# EAGLE design frontend_v2 (EAGLE 6.2)

## Sheet 1 of 4
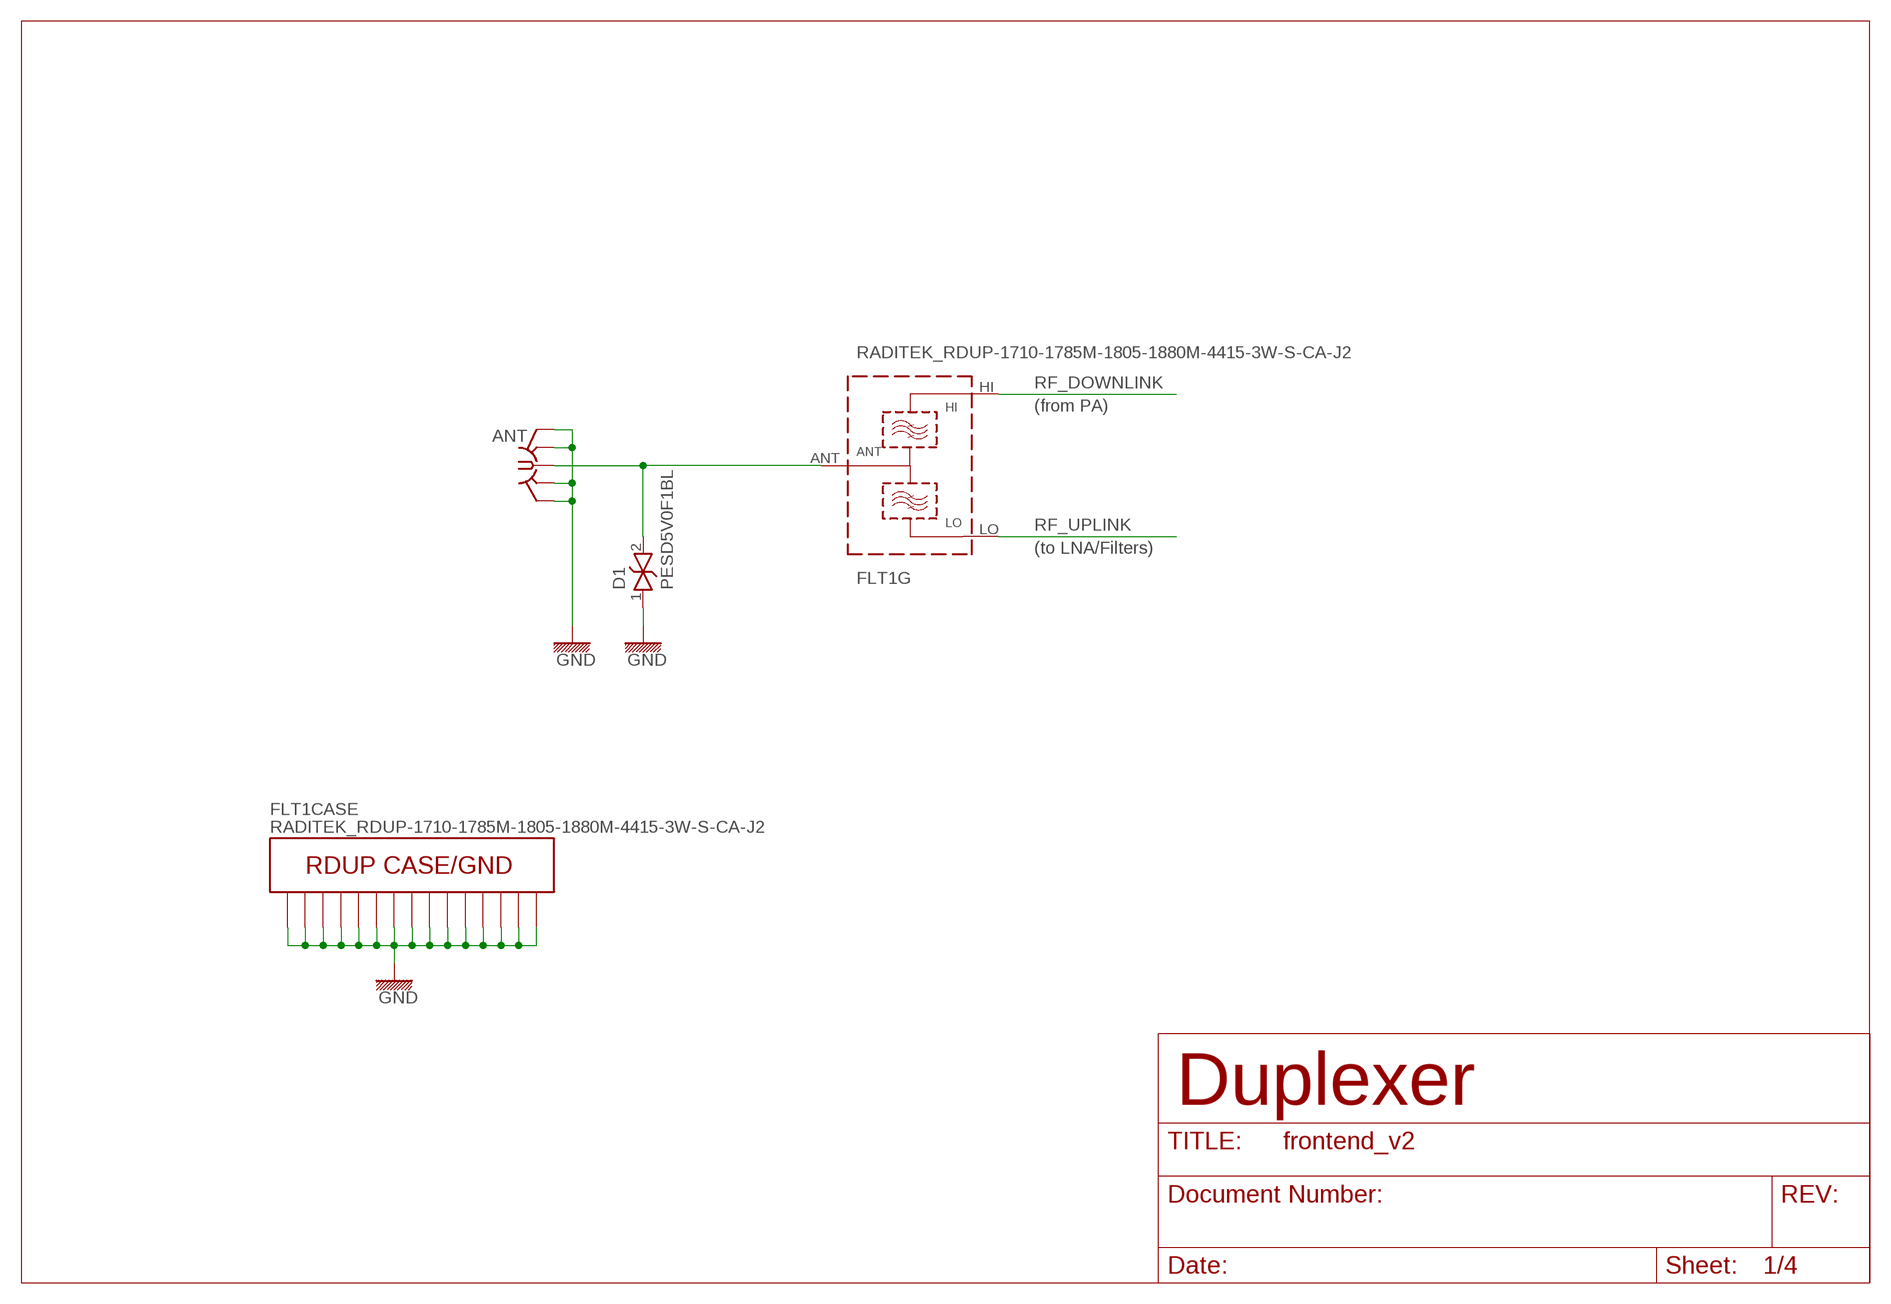
[diagram p0: schematic, sheet 1]

### Parts
ANT  SMA-F-S-TH  [SMA-F-S-TH]
D1  PESD5V0F1BL  D_ESD_SOD882  [SOD882]
FLT1  RADITEK_RDUP-1710-1785M-1805-1880M-4415-3W-S-CA-J2  [RADITEK_RDUP_4415]

### Nets
GND: ANT.G1(GND) ANT.G2(GND) ANT.G3(GND) ANT.G4(GND) D1.1 FLT1.GND@1(CASE:GND) FLT1.GND@2(CASE:GND) FLT1.GND@3(CASE:GND) FLT1.GND@4(CASE:GND) FLT1.GND@5(CASE:GND) FLT1.GND@6(CASE:GND) FLT1.GND@7(CASE:GND) FLT1.GND@8(CASE:GND) FLT1.GND@9(CASE:GND) FLT1.GND@10(CASE:GND) FLT1.GND@11(CASE:GND) FLT1.GND@12(CASE:GND) FLT1.GND@13(CASE:GND) FLT1.GND@14(CASE:GND) FLT1.GND@15(CASE:GND) ; also sheet 2,3,4
RF_ANT: ANT.C D1.2 FLT1.ANT(G:ANT)
RF_DOWNLINK: FLT1.HI(G:HI) ; also sheet 3
RF_UPLINK: FLT1.LO(G:LO) ; also sheet 2

### Notes on the sheet
- (from PA)
- (to LNA/Filters)
- Duplexer

## Sheet 2 of 4
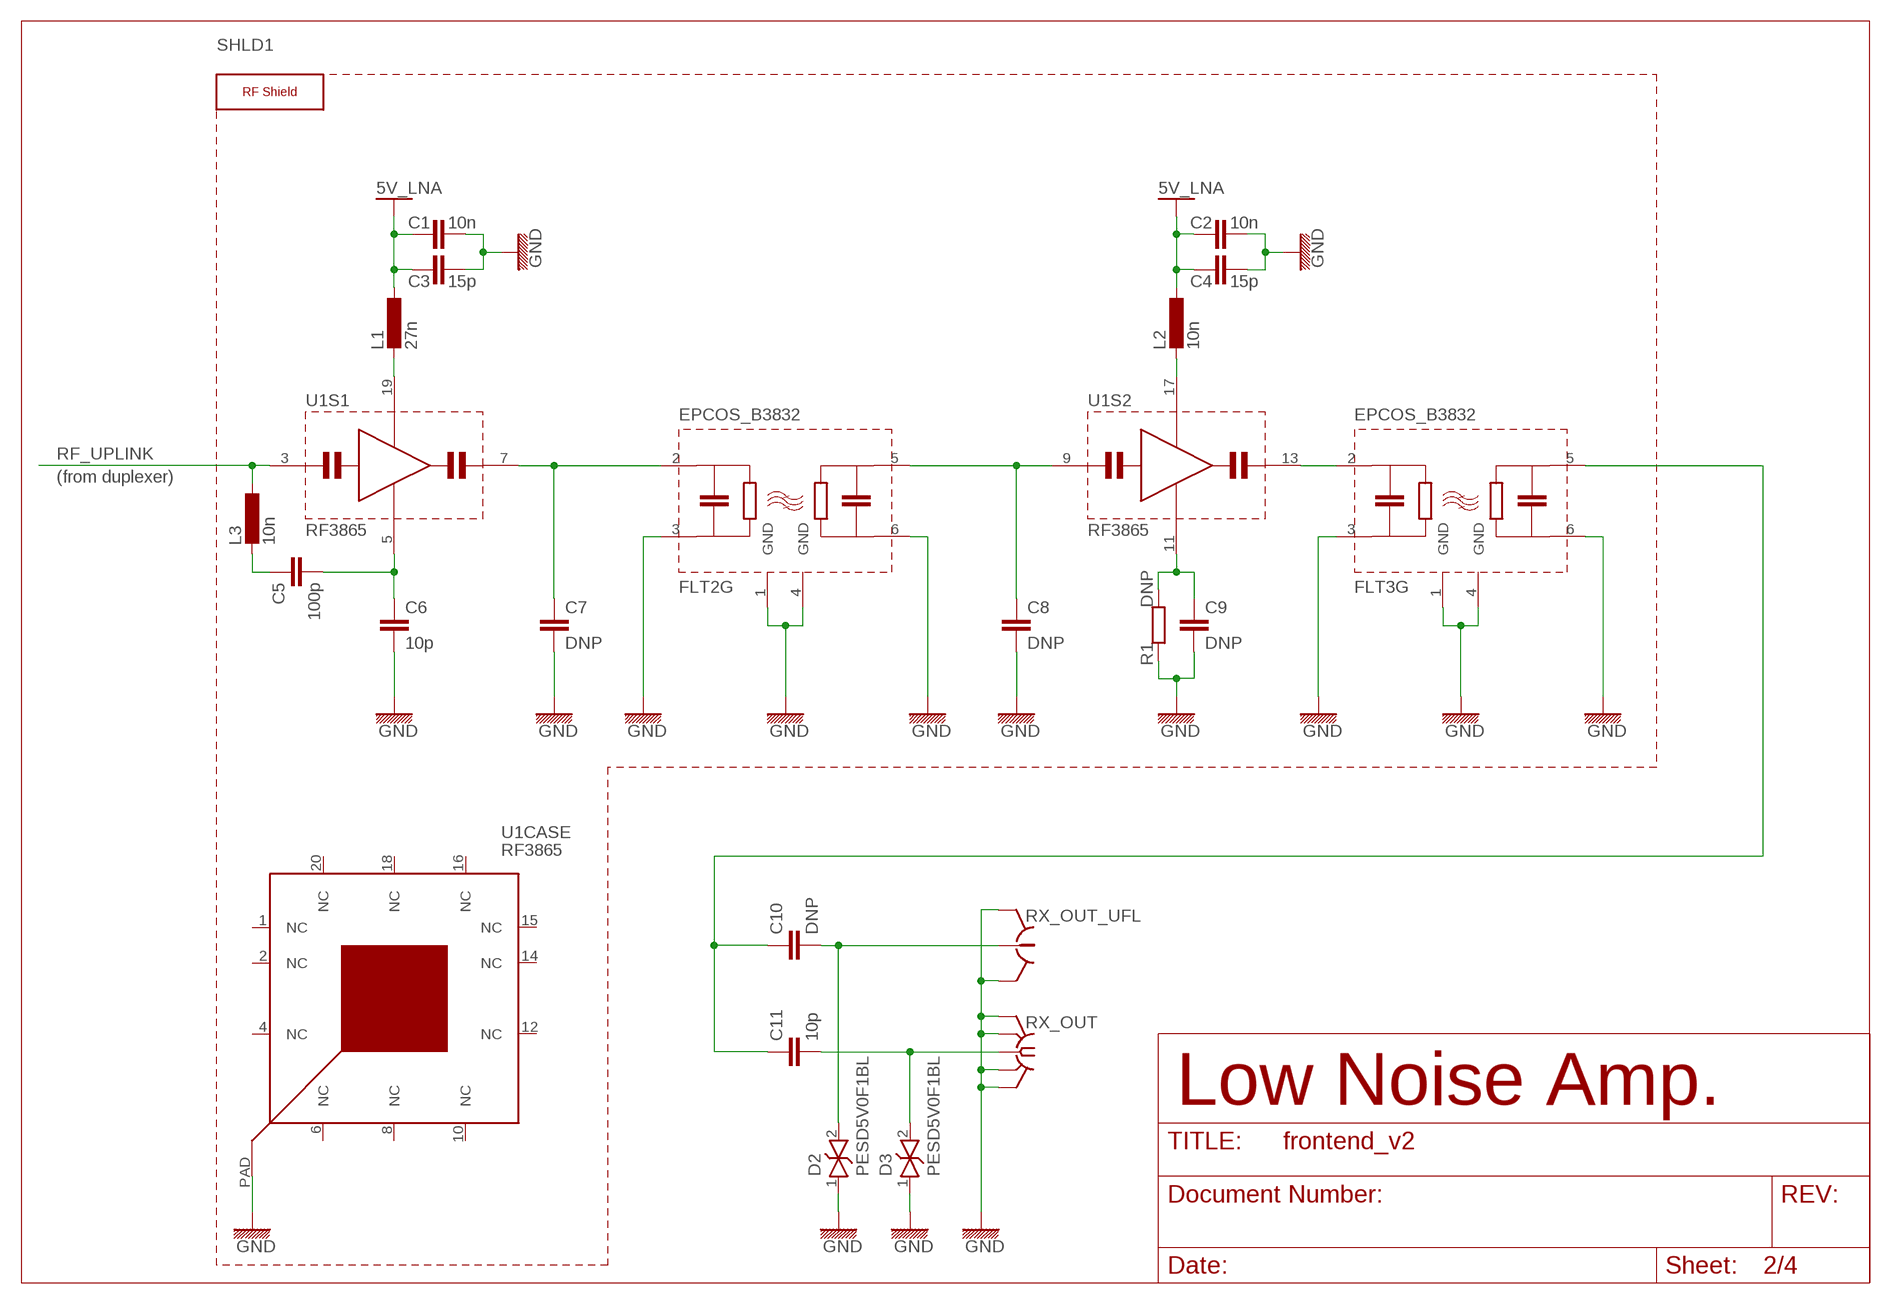
[diagram p1: schematic, sheet 2]

### Parts
C1  10n  C-EU_0603  [0603]
C2  10n  C-EU_0603  [0603]
C3  15p  C-EU_0603  [0603]
C4  15p  C-EU_0603  [0603]
C5  100p  C-EU_0603  [0603]
C6  10p  C-EU_0603  [0603]
C7  DNP  C-EU_0603  [0603]
C8  DNP  C-EU_0603  [0603]
C9  DNP  C-EU_0603  [0603]
C10  DNP  C-EU_0603  [0603]
C11  10p  C-EU_0603  [0603]
D2  PESD5V0F1BL  D_ESD_SOD882  [SOD882]
D3  PESD5V0F1BL  D_ESD_SOD882  [SOD882]
FLT2  EPCOS_B3832  [DCC6C]
FLT3  EPCOS_B3832  [DCC6C]
L1  27n  L-EU_0603  [0603]
L2  10n  L-EU_0603  [0603]
L3  10n  L-EU_0603  [0603]
R1  DNP  R-EU_0603  [0603]
RX_OUT  SMA-F-S-TH  [SMA-F-S-TH]
RX_OUT_UFL  HRS_UFL  [HRS_UFL]
SHLD1  SHIELD25X25  [WE-SHC-SMD_25X25]
U1  RF3865  [QFN20_5X5_PAD]

### Nets
5V_LNA: C1.1 C2.1 C3.1 C4.1 L1.1 L2.1 ; also sheet 4
GND: C1.2 C2.2 C3.2 C4.2 C6.2 C7.2 C8.2 C9.2 D2.1 D3.1 FLT2.1(CASE:GND) FLT2.3(G:IN_GND) FLT2.4(CASE:GND) FLT2.6(G:OUT_GND) FLT3.1(CASE:GND) FLT3.3(G:IN_GND) FLT3.4(CASE:GND) FLT3.6(G:OUT_GND) R1.1 RX_OUT.G1(GND) RX_OUT.G2(GND) RX_OUT.G3(GND) RX_OUT.G4(GND) RX_OUT_UFL.GND@1(GND) RX_OUT_UFL.GND@2(GND) U1.PAD(CASE:CASE_GND) ; also sheet 1,3,4
N$1: L1.2 U1.19(S1:VDD)
N$4: C5.1 L3.2
N$5: C5.2 C6.1 U1.5(S1:AC_GND)
N$6: C9.1 R1.2 U1.11(S2:AC_GND)
N$8: C10.2 D2.2 RX_OUT_UFL.SIG
N$9: C10.1 C11.1 FLT3.5(G:OUT)
N$10: L2.2 U1.17(S2:VDD)
RF_UPLINK: L3.1 U1.3(S1:RF_IN) ; also sheet 1
RF_UPLINK_IS_IN: C8.1 FLT2.5(G:OUT) U1.9(S2:RF_IN)
RF_UPLINK_IS_OUT: C7.1 FLT2.2(G:IN) U1.7(S1:RF_OUT)
RF_UPLINK_LNA_OUT: FLT3.2(G:IN) U1.13(S2:RF_OUT)
RF_UPLINK_OUT: C11.2 D3.2 RX_OUT.C
Unconnected: U1.1(CASE:NC) U1.2(CASE:NC) U1.4(CASE:NC) U1.6(CASE:NC) U1.8(CASE:NC) U1.10(CASE:NC) U1.12(CASE:NC) U1.14(CASE:NC) U1.15(CASE:NC) U1.16(CASE:NC) U1.18(CASE:NC) U1.20(CASE:NC)

### Notes on the sheet
- (from duplexer)
- Low Noise Amp.

## Sheet 3 of 4
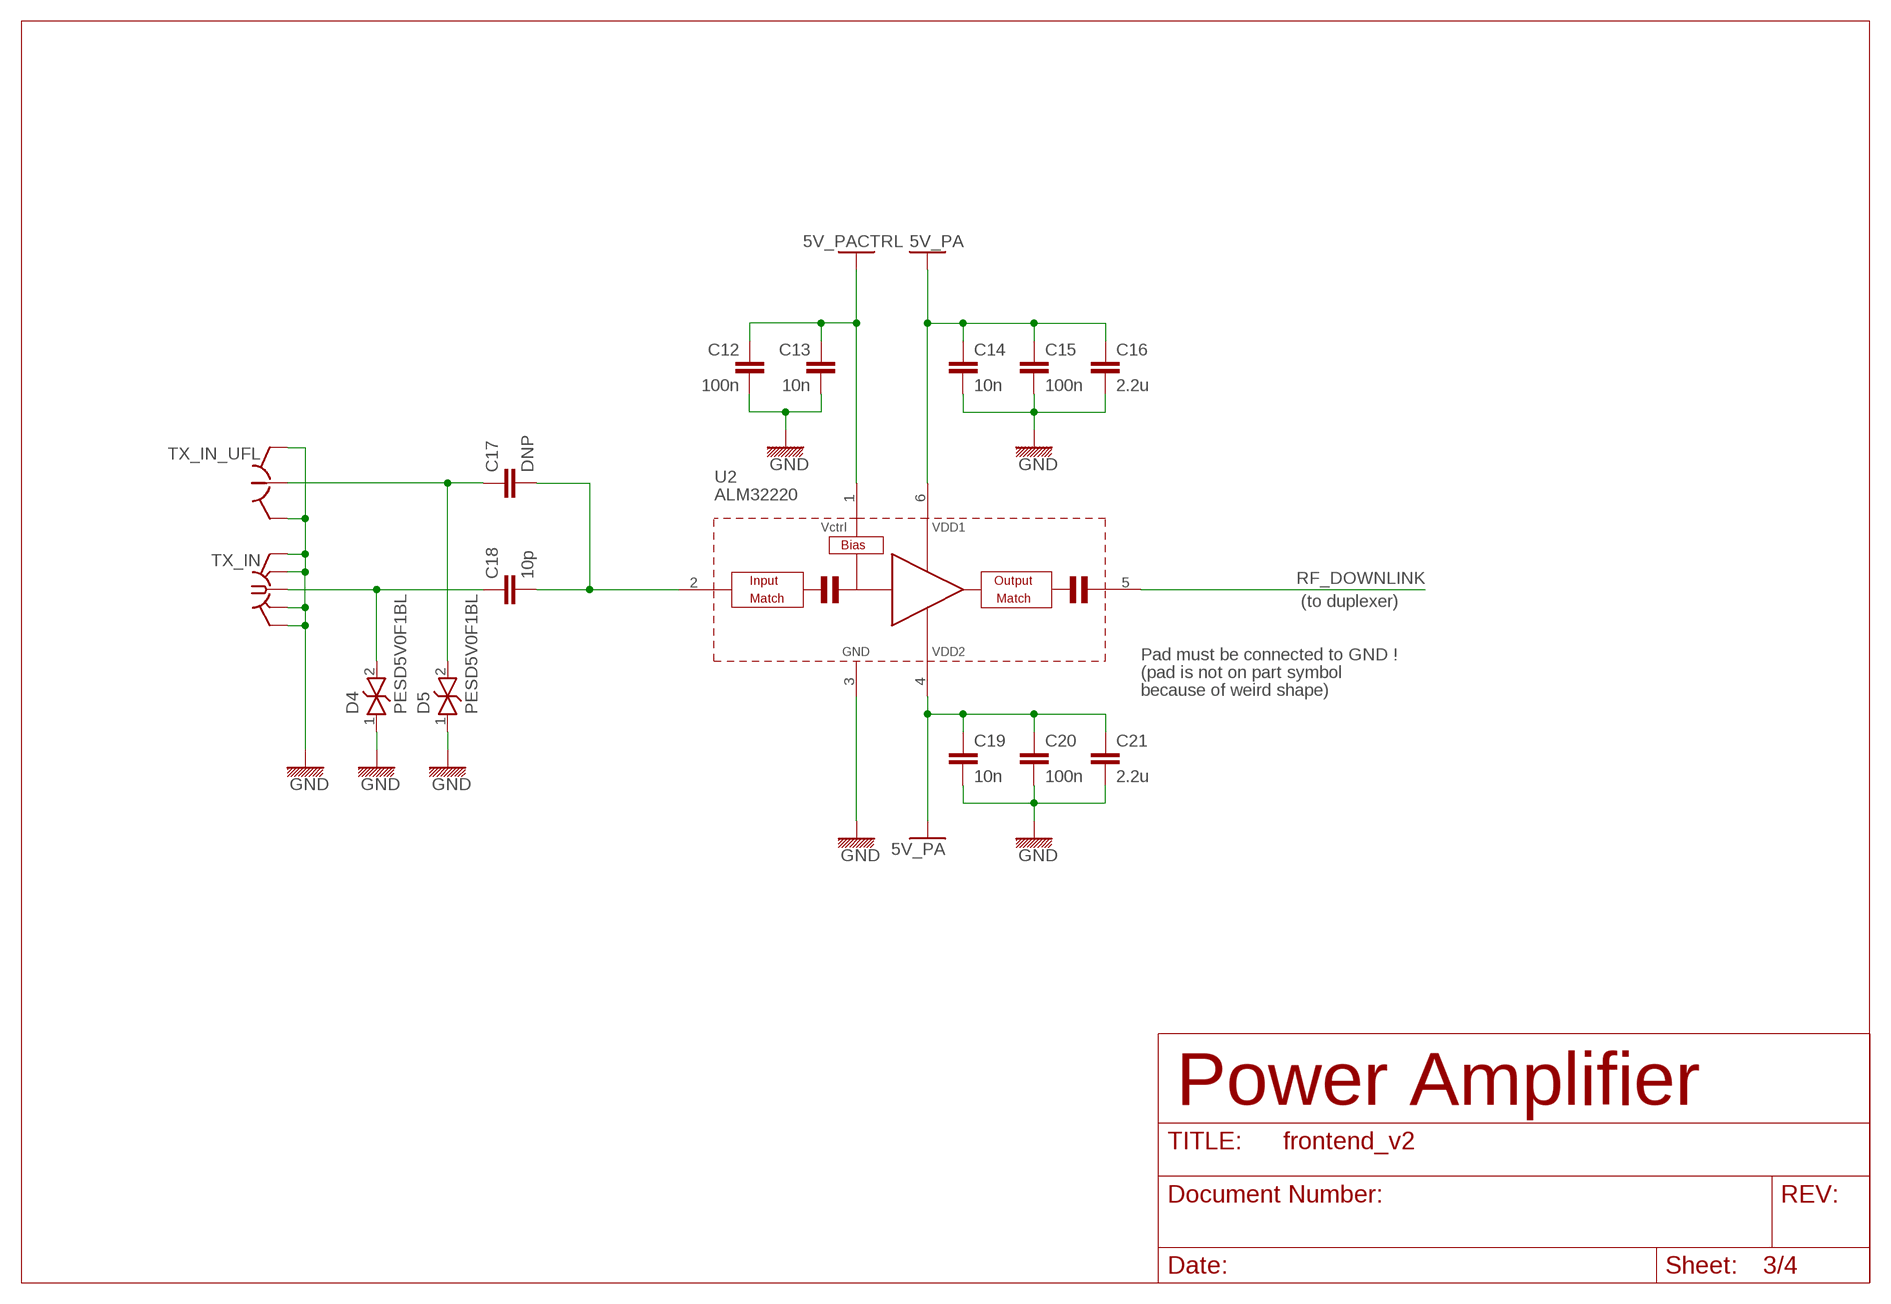
[diagram p2: schematic, sheet 3]

### Parts
C12  100n  C-EU_0603  [0603]
C13  10n  C-EU_0603  [0603]
C14  10n  C-EU_0603  [0603]
C15  100n  C-EU_0603  [0603]
C16  2.2u  C-EU_0805  [0805]
C17  DNP  C-EU_0603  [0603]
C18  10p  C-EU_0603  [0603]
C19  10n  C-EU_0603  [0603]
C20  100n  C-EU_0603  [0603]
C21  2.2u  C-EU_0805  [0805]
D4  PESD5V0F1BL  D_ESD_SOD882  [SOD882]
D5  PESD5V0F1BL  D_ESD_SOD882  [SOD882]
TX_IN  SMA-F-S-TH  [SMA-F-S-TH]
TX_IN_UFL  HRS_UFL  [HRS_UFL]
U2  ALM32220  [ALM32X20]

### Nets
5V_PA: C14.1 C15.1 C16.1 C19.1 C20.1 C21.1 U2.4(VDD2) U2.6(VDD1) ; also sheet 4
5V_PACTRL: C12.1 C13.1 U2.1(VCTRL) ; also sheet 4
GND: C12.2 C13.2 C14.2 C15.2 C16.2 C19.2 C20.2 C21.2 D4.1 D5.1 TX_IN.G1(GND) TX_IN.G2(GND) TX_IN.G3(GND) TX_IN.G4(GND) TX_IN_UFL.GND@1(GND) TX_IN_UFL.GND@2(GND) U2.3(GND) ; also sheet 1,2,4
N$2: C18.1 D4.2 TX_IN.C
N$3: C17.2 C18.2 U2.2(RF_IN)
N$14: C17.1 D5.2 TX_IN_UFL.SIG
RF_DOWNLINK: U2.5(RF_OUT) ; also sheet 1

### Notes on the sheet
- (to duplexer)
- Pad must be connected to GND !
- (pad is not on part symbol
- because of weird shape)
- Power Amplifier

## Sheet 4 of 4
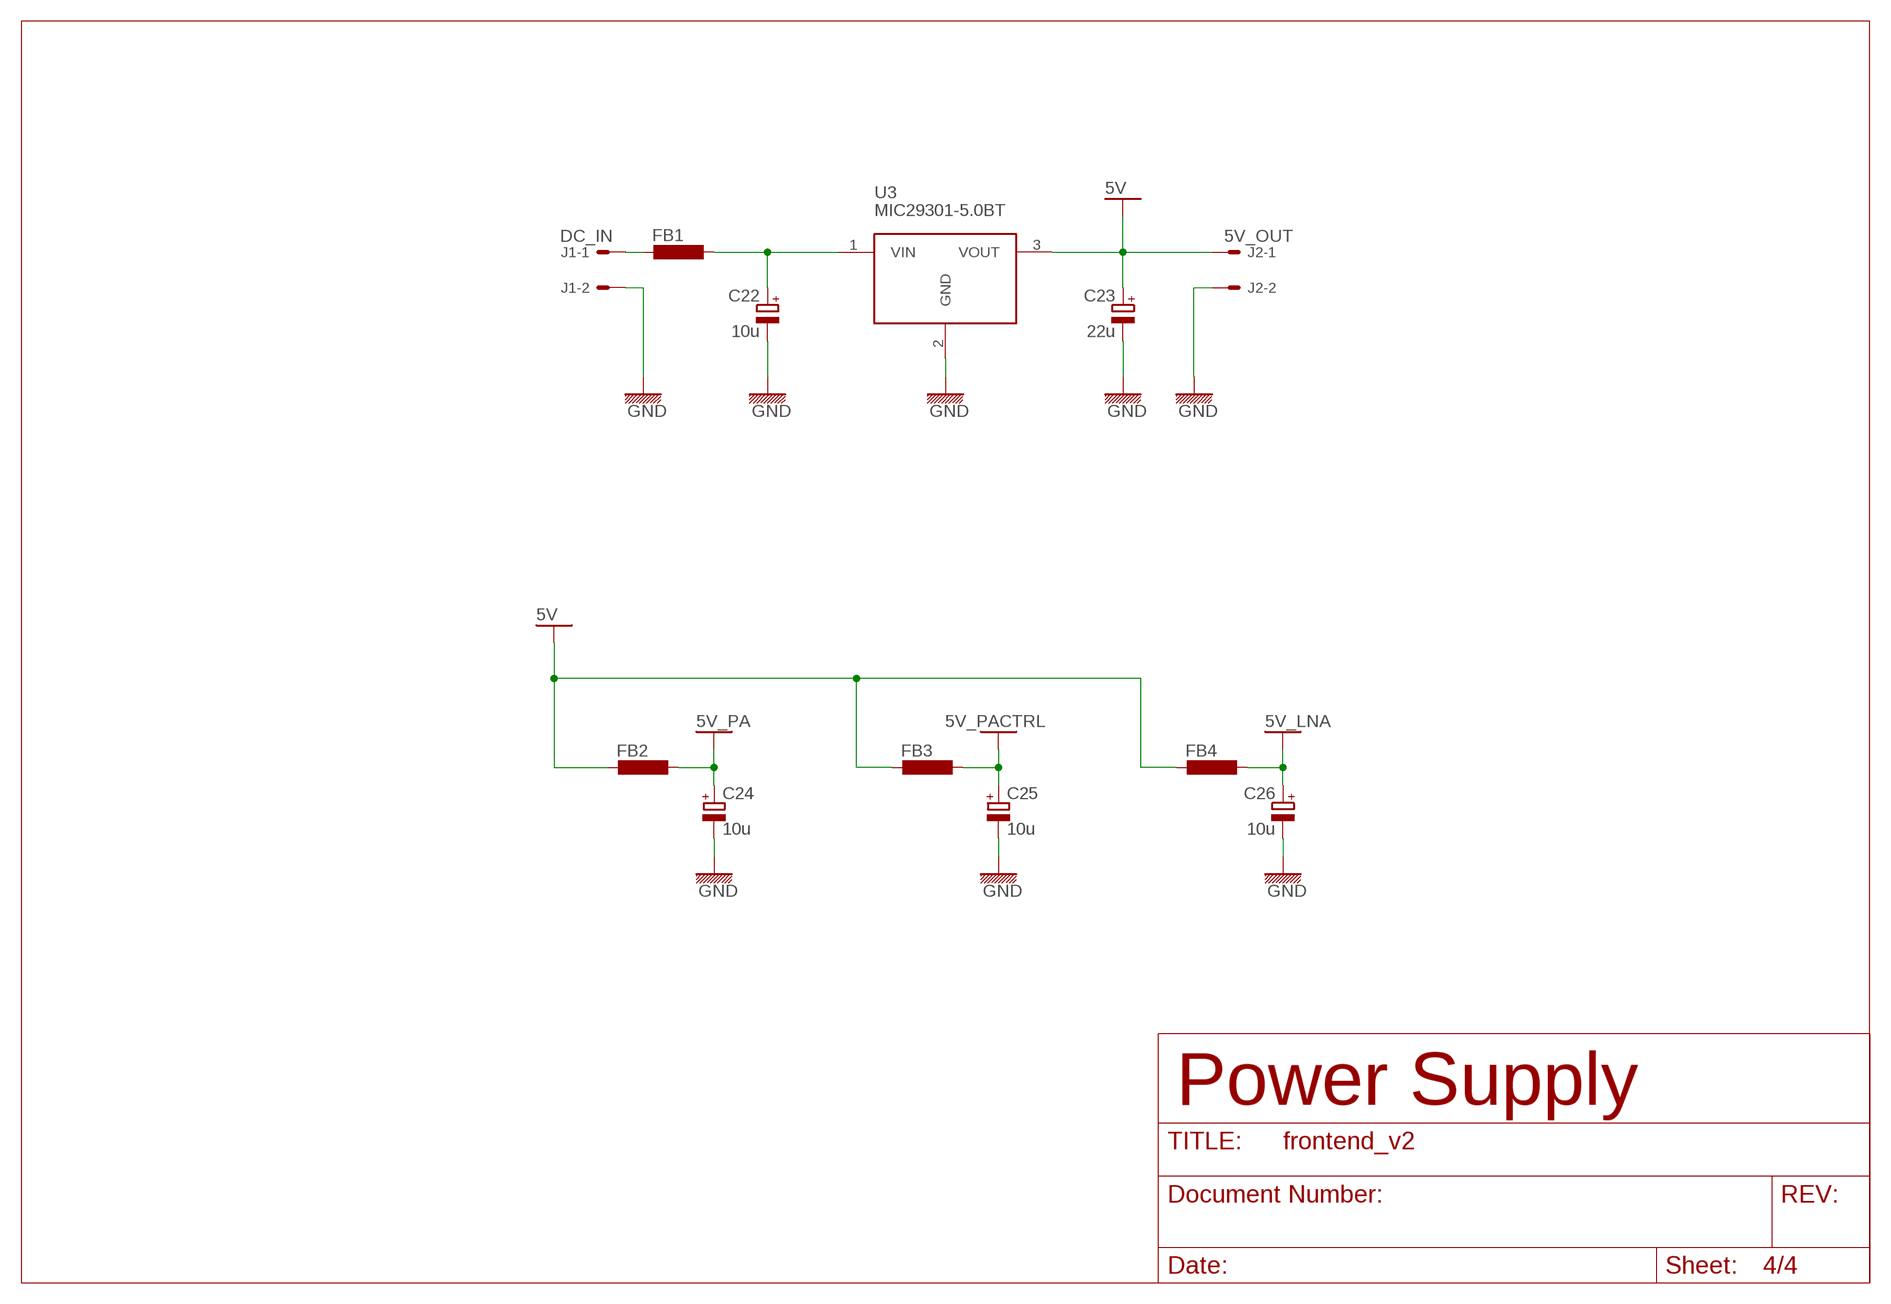
[diagram p3: schematic, sheet 4]

### Parts
C22  10u  CPOL-EUSMCA  [SMC_A]
C23  22u  CPOL-EUSMCA  [SMC_A]
C24  10u  CPOL-EUSMCA  [SMC_A]
C25  10u  CPOL-EUSMCA  [SMC_A]
C26  10u  CPOL-EUSMCA  [SMC_A]
FB1  FBEAD_1206  [1206]
FB2  FBEAD_1206  [1206]
FB3  FBEAD_0603  [0603]
FB4  FBEAD_0603  [0603]
J1  DC_IN  22-27-2021-02  [6410-02]
J2  5V_OUT  22-27-2021-02  [6410-02]
U3  MIC29301-5.0BT  MIC29XXX-FIX_WT_TO220BV  [TO220BV]

### Nets
5V: C23.+ FB2.1 FB3.1 FB4.1 J2.1 U3.3(VOUT)
5V_LNA: C26.+ FB4.2 ; also sheet 2
5V_PA: C24.+ FB2.2 ; also sheet 3
5V_PACTRL: C25.+ FB3.2 ; also sheet 3
DC_IN: FB1.1 J1.1
DC_IN_FLT: C22.+ FB1.2 U3.1(VIN)
GND: C22.- C23.- C24.- C25.- C26.- J1.2 J2.2 U3.2(GND) ; also sheet 1,2,3

### Notes on the sheet
- Power Supply

## Library data of the parts
ANT RX_OUT TX_IN = we_conn:SMA-F
C1-C21 = we_passive:C-EU: Capacitor
C22-C26 = rcl:CPOL-EU: POLARIZED CAPACITOR, European symbol
D1-D5 = we_passive:D_ESD: Diode for ESD Protection Transient suppressors
FB1-FB4 = we_passive:FBEAD: INDUCTOR SMD Bead inductor
FLT1 = we_passive:RADITEK_RDUP-1710-1785M-1805-1880M-4415-3W-S-CA-J2
FLT2 FLT3 = we_passive:EPCOS_B3832
J1 J2 = con-molex:22-?-02: CONNECTOR wire to board 2.54 mm (.1 inch) pitch header; OC_FARNELL: unknown; OC_NEWARK: unknown
L1-L3 = we_passive:L-EU: Inductor
R1 = we_passive:R-EU: Resistor
RX_OUT_UFL TX_IN_UFL = we_conn:HRS_UFL: Hirose U.FL SMT
SHLD1 = we_mech:SHIELD: RF Shield
U1 = we_chips:RF3865: RF3865 wide bandwidth, high linearity low noise amplifier (LNA) / llinear driver
U2 = we_chips:ALM32220
U3 = we_chips:MIC29XXX-FIX: Micrel MIC29xxx series (fixed output versions)

## Board
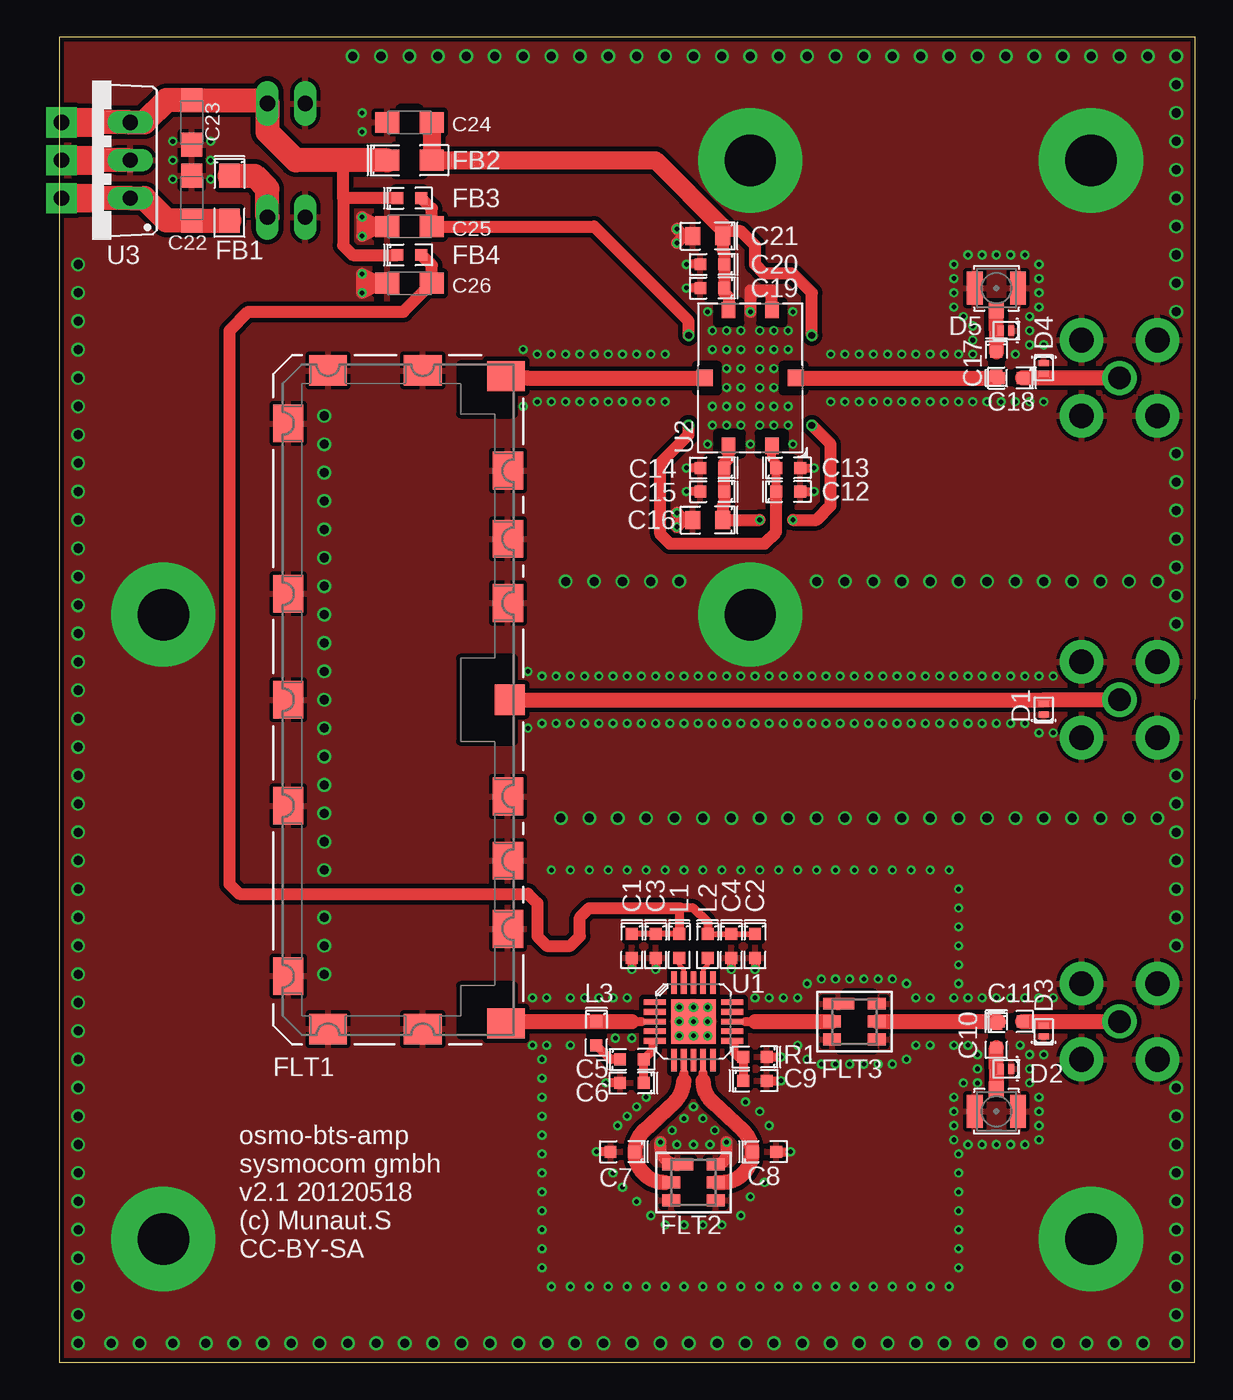
[diagram p4: board, top side]
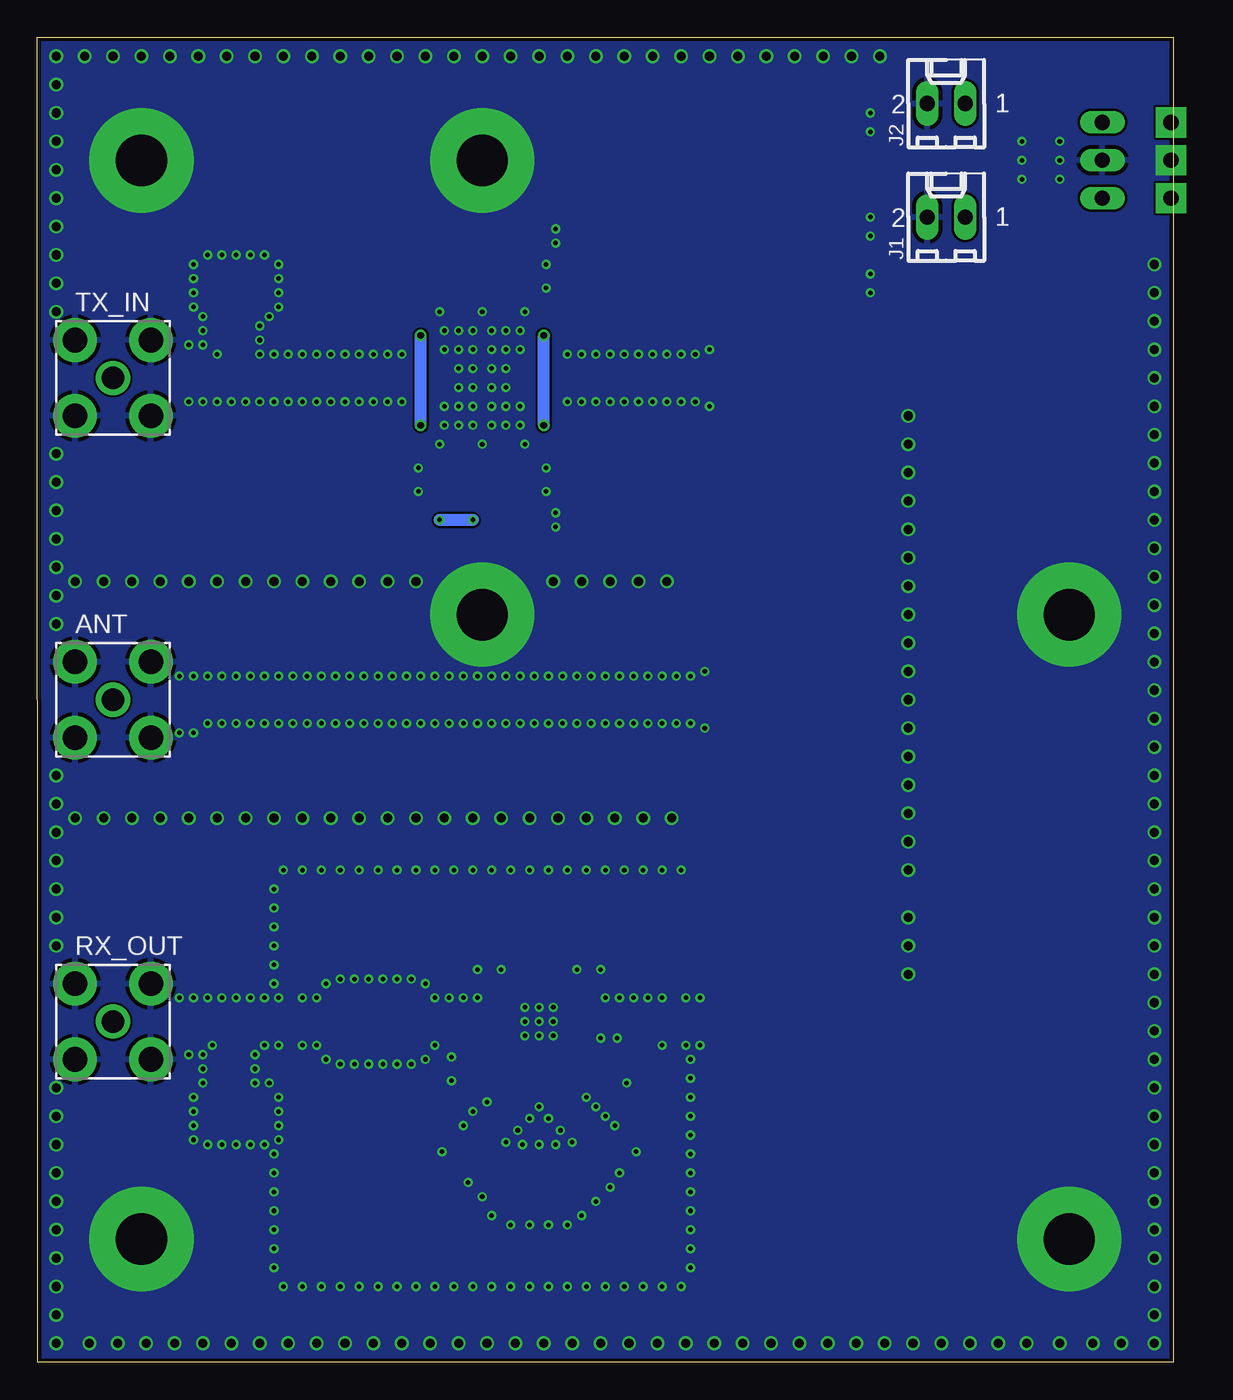
[diagram p5: board, bottom side, seen from below]

Size 76.2 x 88.9 mm. Coordinates in mm from the lower left corner, seen from the top.
Outline: 0,0 76.18,0 76.2,88.9 0,88.9 0,0
Copper layers (1*16): Top 0.035mm / dielectric 1.5mm / Bottom 0.035mm
Design rules: minimum track width 6mil, minimum drill 12mil, track to track 6mil, track to pad 6mil, pad to pad 6mil, via to via 6mil, smd to smd 0mil, copper to edge 10mil, drill to drill 10mil, minimum pad ring 10mil, minimum via ring 6mil, stop-mask expansion 2mil, vias tented up to drill 100mil, thermal gap 10mil
tRestrict: area 41.9,10.2 to 43.5,13.3; area 41.6,10.2 to 41.9,10.5; area 52.7,21 to 54.6,24.8; area 52.4,21 to 52.7,21.3; area 22.5,71.4 to 24.4,78.7; area 22.5,79.7 to 24.4,81.6; area 22.9,82.2 to 24.1,84.1; area 48.6,57.8 to 49.2,60.6; area 43.2,55.6 to 43.8,57.5; area 43.5,57.8 to 44.1,60.6; area 43.5,71.4 to 44.1,74.3; area 43.2,74.6 to 43.8,76.5

### Footprints (pad centres in the part's own frame; a part is rotated, then mirrored left to right if it is on the bottom)
SMA-F-S-TH = drill 1.524: C 0,0 | drill 1.651 pad 2.921: G1 -2.54,2.54; G2 2.54,2.54; G3 -2.54,-2.54; G4 2.54,-2.54
0603 = smd 0.8 x 0.8: 1 -0.8,0; 2 0.8,0
0805 = smd 1 x 1.2: 1 -1,0; 2 1,0
SMC_A = smd 1.6 x 1.4: + -1.5,0; - 1.5,0
SOD882 = smd 0.4 x 0.7: 1 -0.35,0; 2 0.35,0
1206 = smd 1.6 x 1.4: 1 -1.5,0; 2 1.5,0
RADITEK_RDUP_4415 = smd 2.032 x 2.032: ANT 0,0.254 | smd 2.54 x 2.032: GND@1 -15.367,0.381; GND@2 -10.795,0.381; GND@3 -6.477,0.381; GND@4 6.477,0.381; GND@5 10.795,0.381; GND@6 15.367,0.381; GND@9 18.542,15.113; GND@10 7.112,15.113; GND@11 0,15.113; GND@12 -7.112,15.113; GND@13 -18.542,15.113 | smd 2.032 x 2.54: GND@7 22.098,6.096; GND@8 22.098,12.446; GND@14 -22.098,12.446; GND@15 -22.098,6.096; HI 21.717,0.508; LO -21.717,0.508
DCC6C = smd 0.8 x 2.1: 1 1.2,1.05 | smd 0.8 x 1.2: 2 0,1.5; 3 -1.2,1.5; 4 -1.2,-1.5; 5 0,-1.5; 6 1.2,-1.5
6410-02 = drill 1.016 long: 1 1.27,0; 2 -1.27,0
HRS_UFL = smd 1.05 x 2.2: GND@1 -1.452,0; GND@2 1.452,0 | smd 1 x 1.05: SIG 0,-1.502
QFN20_5X5_PAD = smd 1.5 x 0.375: 1 -2.6,1.3; 2 -2.6,0.65; 3 -2.6,0; 4 -2.6,-0.65; 5 -2.6,-1.3; 11 2.6,-1.3; 12 2.6,-0.65; 13 2.6,0; 14 2.6,0.65; 15 2.6,1.3 | smd 0.375 x 1.5: 6 -1.3,-2.6; 7 -0.65,-2.6; 8 0,-2.6; 9 0.65,-2.6; 10 1.3,-2.6; 16 1.3,2.6; 17 0.65,2.6; 18 0,2.6; 19 -0.65,2.6; 20 -1.3,2.6 | smd 3 x 3: PAD 0,0
ALM32X20 = smd 0.9 x 1.1: 1 -1.45,4.55; 3 -1.45,-4.55; 4 1.45,-4.55; 6 1.45,4.55 | smd 1.1 x 1.1: 2 -3.05,0; 5 3.05,0
TO220BV = drill 1.016 long: 1 -2.54,-2.54; 2 0,-2.54; 3 2.54,-2.54

### Placement (x,y rotation side)
ANT  71.12,44.45 180 bottom
C1  38.42,27.94 270 top
C2  46.67,27.94 270 top
C3  40.01,27.94 270 top
C4  45.09,27.94 270 top
C5  38.42,20.32 0 top
C6  38.42,18.73 180 top
C7  37.78,14.13 180 top
C8  47.31,14.13 0 top
C9  46.67,18.89 0 top
C10  62.87,21.91 270 top
C11  63.82,22.86 0 top
C12  48.9,58.42 0 top
C13  48.9,60.01 0 top
C14  43.81,60.01 180 top
C15  43.81,58.42 180 top
C16  43.5,56.52 180 top
C17  62.87,66.99 270 top
C18  63.82,66.04 180 top
C19  43.81,72.07 180 top
C20  43.81,73.66 180 top
C21  43.5,75.56 180 top
C22  8.89,78.11 90 top
C23  8.89,83.19 270 top
C24  23.5,83.19 180 top
C25  23.5,76.2 180 top
C26  23.5,72.39 180 top
D1  66.04,43.81 90 top
D2  63.5,19.68 180 top
D3  66.04,22.23 90 top
D4  66.04,66.67 270 top
D5  63.5,69.22 180 top
FB1  11.43,78.11 270 top
FB2  23.5,80.64 0 top
FB3  23.5,78.11 0 top
FB4  23.5,74.3 0 top
FLT1  30.48,44.45 90 top
FLT2  42.55,12.06 90 top
FLT3  53.34,22.86 90 top
J1  15.24,76.83 0 bottom
J2  15.24,84.45 0 bottom
L1  41.59,27.94 270 top
L2  43.5,27.94 270 top
L3  36.04,22.07 270 top
R1  46.67,20.48 180 top
RX_OUT  71.12,22.86 180 bottom
RX_OUT_UFL  62.87,16.83 180 top
SHLD1  46.35,19.05 0 top
TX_IN  71.12,66.04 180 bottom
TX_IN_UFL  62.87,72.07 0 top
U1  42.55,22.86 0 top
U2  46.35,66.04 180 top
U3  2.22,80.64 90 top

### Tracks (layer width: path | path; a pad name or v marks a point on that pad's centre or on a via)
5V  (via drill 1.02 pad 2.03)
  Top 0.813: FB3.1 19.05,78.11 | 19.05,78.11 19.05,80.64 | 19.05,78.11 19.05,74.93 19.68,74.3 FB4.1
  Top 1.626: v0.16,83.19 U3.3 5.71,83.19 7.21,84.69 C23.+ 13.74,84.69 J2.1 13.97,82.55 15.88,80.64 19.05,80.64 FB2.1
5V_LNA
  Top 0.406: C1.1 C3.1 L1.1 | L2.1 C4.1 C2.1
  Top 0.61: L2.1 43.5,29.53 42.55,30.48 41.59,30.48 L1.1
  Top 0.813: 41.59,30.48 35.56,30.48 34.92,29.84 34.92,28.57 34.29,27.94 32.7,27.94 32.07,28.57 32.07,30.8 31.43,31.43 12.06,31.43 11.43,32.07 11.43,69.22 12.7,70.48 23.09,70.48 C26.+ 25,73.59 FB4.2
5V_PA  (via drill 0.3, 0.46)
  Top 0.813: U2.6 44.91,60.62 44.61,60.33 C14.1 C15.1 44.62,57.62 44.5,57.42 C16.1 v46.99,56.52 | U2.4 44.91,71.46 44.61,71.75 C19.1 C20.1 44.62,74.46 44.5,74.66 C21.1 44.77,75.83 44.77,75.88 | v49.21,56.52 50.8,56.52 51.75,57.47 51.75,61.59 v50.48,62.87 | v50.48,68.9 50.48,71.75 49.21,73.03 47.31,73.03 46.67,73.66 46.67,74.93 45.72,75.88 44.77,75.88 | 44.77,75.88 44.45,76.2
  Top 1.219: C24.+ FB2.2 40.01,80.64 44.45,76.2
  Bottom 0.813: v46.99,56.52 v49.21,56.52 | v50.48,62.87 v50.48,68.9
5V_PACTRL  (via drill 0.46)
  Top 0.61: U2.1 47.8,60.62 48.09,60.33 C13.1 C12.1
  Top 0.813: C12.1 48.09,55.72 47.31,54.93 40.96,54.93 40.32,55.56 40.32,60.33 42.23,62.23 v42.23,62.87 | v42.23,68.9 42.23,69.85 35.88,76.2 C25.+ 25,77.41 FB3.2
  Bottom 0.813: v42.23,62.87 v42.23,68.9
DC_IN
  Top 1.626: J1.1 13.97,78.74 13.11,79.61 FB1.1
DC_IN_FLT  (via drill 1.02 pad 2.03)
  Top 1.626: v0.16,78.11 U3.1 5.71,78.11 7.21,76.61 C22.+ FB1.2
GND  (via drill 0.3, 0.61, 1.02 pad 2.03, 3.45 pad 7)
  Top 0.61: C1.2 v38.42,26.35 | C3.2 v40.01,26.35 | C4.2 v45.09,26.35 | C2.2 v46.67,26.35 | C6.2 v36.67,18.73 | C9.2 v48.42,18.89 | R1.1 v48.42,20.48 | C8.2 v49.05,14.13 | v49.05,14.13 | C7.2 v36.04,14.13 | C20.2 v42.07,73.66 | C19.2 v42.07,72.07 | C14.2 v42.07,60.01 | C15.2 v42.07,58.42 | C13.2 v50.64,60.01 | C12.2 v50.64,58.42
  Top 0.813: 41.91,75.56 | v41.43,75.09 41.91,75.56 | 41.91,75.56 C21.2 | 41.91,75.56 v41.43,76.04 | v41.43,56.04 41.91,56.52 | C16.2 41.91,56.52 | 41.91,56.52 v41.43,56.99 | 21.59,76.2 v20.32,76.83 v20.32,75.56 21.59,76.2 | C25.- 21.59,76.2 | 21.59,72.39 v20.32,71.75 v20.32,73.03 21.59,72.39 | C26.- 21.59,72.39 | FLT2.1 arc-90 40.32,14.44 v40.32,14.76 | FLT2.6 arc90 44.77,13.99 v44.77,14.76 | U2.3 47.8,71.91 46.35,71.91 v46.35,70.48
  Top 1.626: U3.2 v0.16,80.64
  other vias: 41.59,23.81 42.55,23.81 43.5,23.81 43.5,22.86 43.5,21.91 42.55,21.91 42.55,22.86 41.59,22.86 41.59,21.91 42.55,17.14 41.91,16.35 41.12,15.56 43.18,16.35 43.97,15.56 43.66,14.61 41.43,14.61 42.55,14.61 37.31,21.75 38.42,21.75 58.1,46.04 45.72,66.67 44.77,66.67 46.99,66.67 47.94,66.67 47.94,65.41 46.99,65.41 45.72,65.41 44.77,65.41 44.77,64.14 45.72,64.14 46.99,64.14 47.94,64.14 45.72,67.94 44.77,67.94 46.99,67.94 47.94,67.94 47.94,69.22 46.99,69.22 45.72,69.22 44.77,69.22 44.77,62.87 45.72,62.87 46.99,62.87 47.94,62.87 48.9,64.14 48.9,62.87 43.81,64.14 43.81,62.87 43.81,67.94 43.81,69.22 48.9,69.22 48.9,67.94 43.5,70.48 49.21,70.48 46.35,61.59 43.5,61.59 49.21,61.59 31.75,24.45 32.7,24.45 35.24,24.45 36.2,24.45 37.15,24.45 38.1,24.45 31.75,21.27 32.7,21.27 46.67,24.45 47.62,24.45 48.58,24.45 49.53,24.45 50.16,25.4 51.12,25.72 52.07,25.72 53.02,25.72 53.98,25.72 54.93,25.72 49.53,21.27 50.16,20.32 51.12,20 52.07,20 53.02,20 53.98,20 54.93,20 55.88,20 56.83,20.32 55.88,25.72 56.83,25.4 57.47,24.45 58.42,24.45 57.47,21.27 58.42,21.27 60.01,21.27 33.34,46.04 34.29,46.04 35.24,46.04 36.2,46.04 37.15,46.04 38.1,46.04 39.05,46.04 40.01,46.04 40.96,46.04 41.91,46.04 42.86,46.04 43.81,46.04 44.77,46.04 33.34,42.86 34.29,42.86 35.24,42.86 36.2,42.86 37.15,42.86 38.1,42.86 39.05,42.86 40.01,42.86 40.96,42.86 41.91,42.86 42.86,42.86 43.81,42.86 44.77,42.86 45.72,42.86 46.67,42.86 47.62,42.86 48.58,42.86 49.53,42.86 50.48,42.86 51.44,42.86 52.39,42.86 53.34,42.86 54.29,42.86 55.24,42.86 56.2,42.86 57.15,42.86 58.1,42.86 59.05,42.86 60.01,42.86 45.72,46.04 46.67,46.04 47.62,46.04 48.58,46.04 49.53,46.04 50.48,46.04 51.44,46.04 52.39,46.04 53.34,46.04 54.29,46.04 55.24,46.04 56.2,46.04 57.15,46.04 59.05,46.04 33.02,67.63 33.97,67.63 34.92,67.63 35.88,67.63 36.83,67.63 37.78,67.63 38.73,67.63 39.69,67.63 40.64,67.63 33.02,64.45 33.97,64.45 34.92,64.45 35.88,64.45 36.83,64.45 37.78,64.45 38.73,64.45 39.69,64.45 40.64,64.45 51.75,67.63 52.7,67.63 53.66,67.63 54.61,67.63 55.56,67.63 56.52,67.63 57.47,67.63 58.42,67.63 59.37,67.63 60.33,67.63 60.33,64.45 59.37,64.45 58.42,64.45 57.47,64.45 56.52,64.45 55.56,64.45 54.61,64.45 53.66,64.45 52.7,64.45 51.75,64.45 74.93,74.3 74.93,76.2 74.93,78.11 74.93,80.01 51.75,1.27 74.93,1.27 74.93,3.17 74.93,5.08 74.93,6.99 49.85,1.27 47.94,1.27 46.04,1.27 44.13,1.27 42.23,1.27 40.32,1.27 38.42,1.27 36.51,1.27 34.61,1.27 32.7,1.27 30.8,1.27 28.89,1.27 26.99,1.27 25.08,1.27 23.18,1.27 21.27,1.27 19.37,1.27 17.46,1.27 15.56,1.27 13.65,1.27 11.75,1.27 9.84,1.27 1.27,1.27 3.49,1.27 5.4,1.27 7.62,1.27 1.27,3.17 1.27,5.08 1.27,6.99 1.27,8.89 1.27,10.79 1.27,12.7 1.27,14.61 1.27,16.51 1.27,18.41 1.27,20.32 71.75,52.39 69.85,52.39 67.94,52.39 66.04,52.39 64.14,52.39 64.14,36.51 66.04,36.51 67.94,36.51 69.85,36.51 71.75,36.51 62.23,36.51 60.33,36.51 58.42,36.51 56.52,36.51 54.61,36.51 52.7,36.51 50.8,36.51 48.9,36.51 46.99,36.51 45.09,36.51 33.66,36.51 43.18,36.51 41.27,36.51 39.37,36.51 37.47,36.51 35.56,36.51 62.23,52.39 60.33,52.39 58.42,52.39 56.52,52.39 54.61,52.39 33.97,52.39 39.69,52.39 37.78,52.39 35.88,52.39 74.93,72.39 73.03,87.63 71.12,87.63 69.22,87.63 67.31,87.63 65.41,87.63 39.37,17.78 38.73,17.14 38.1,16.51 37.47,15.88 37.15,12.7 37.78,11.75 38.73,10.79 39.69,9.84 40.64,9.21 41.91,9.21 43.18,9.21 44.45,9.21 45.72,9.84 46.35,11.11 47.31,12.06 46.04,17.46 46.99,16.83 47.62,15.88 17.78,29.84 17.78,34.92 17.78,33.02 17.78,36.83 17.78,38.73 17.78,40.64 17.78,42.55 17.78,44.45 17.78,46.35 17.78,48.26 17.78,50.16 17.78,52.07 17.78,63.5 17.78,53.98 17.78,55.88 1.27,22.23 1.27,24.13 1.27,26.04 1.27,27.94 1.27,29.84 1.27,31.75 1.27,33.66 1.27,35.56 1.27,37.47 1.27,39.37 1.27,41.27 1.27,43.18 1.27,45.09 1.27,46.99 1.27,48.9 1.27,50.8 1.27,52.7 1.27,54.61 1.27,56.52 1.27,58.42 1.27,60.33 1.27,62.23 17.78,57.78 46.35,50.16 46.35,80.64 7.62,81.92 7.62,80.64 7.62,79.38 10.16,81.92 10.16,80.64 10.16,79.38 6.99,50.16 69.22,8.26 6.99,8.26 69.22,80.64 20.32,83.82 20.32,82.55 34.29,24.45 34.29,21.27 32.38,46.04 31.43,46.35 32.38,42.86 31.43,42.55 32.07,64.45 31.11,64.14 32.07,67.63 31.11,67.94 61.28,67.63 61.28,64.45 62.23,64.45 63.18,64.45 64.14,64.45 64.14,67.63 65.09,64.45 66.04,64.45 65.09,68.26 66.04,68.26 61.28,68.58 61.28,69.53 60.64,70.17 60.01,70.8 60.01,71.75 60.01,72.71 60.01,73.66 60.96,74.3 61.91,74.3 62.87,74.3 63.82,74.3 64.77,74.3 65.72,73.66 65.72,72.71 65.72,71.75 65.72,70.8 65.09,70.17 65.09,69.22 60.01,46.04 60.96,46.04 61.91,46.04 62.87,46.04 63.82,46.04 64.77,46.04 65.72,46.04 66.67,46.04 60.96,42.86 61.91,42.86 62.87,42.86 63.82,42.86 64.77,42.86 65.72,42.23 66.67,42.23 60.01,24.45 60.96,24.45 61.91,24.45 62.87,24.45 63.82,24.45 64.77,24.45 65.72,24.45 66.67,24.45 62.87,14.61 63.82,14.61 64.77,14.61 61.91,14.61 60.96,14.61 60.01,14.92 60.01,15.88 60.01,16.83 60.01,17.78 60.64,18.73 61.59,18.73 60.96,21.27 61.59,20.64 61.59,19.68 65.72,14.92 65.72,15.88 65.72,16.83 65.72,17.78 65.09,18.73 65.09,19.68 65.09,20.64 64.45,21.27 66.04,20.64 33.02,33.02 34.29,33.02 35.56,33.02 36.83,33.02 38.1,33.02 39.37,33.02 40.64,33.02 41.91,33.02 43.18,33.02 44.45,33.02 45.72,33.02 46.99,33.02 48.26,33.02 49.53,33.02 50.8,33.02 52.07,33.02 53.34,33.02 54.61,33.02 55.88,33.02 57.15,33.02 58.42,33.02 59.69,33.02 60.33,31.75 60.33,30.48 60.33,29.21 60.33,27.94 60.33,26.67 60.33,25.4 33.02,5.08 34.29,5.08 35.56,5.08 36.83,5.08 38.1,5.08 39.37,5.08 40.64,5.08 41.91,5.08 43.18,5.08 44.45,5.08 45.72,5.08 46.99,5.08 48.26,5.08 49.53,5.08 50.8,5.08 52.07,5.08 53.34,5.08 54.61,5.08 55.88,5.08 57.15,5.08 58.42,5.08 59.69,5.08 60.33,6.35 60.33,7.62 60.33,8.89 60.33,10.16 60.33,11.43 60.33,12.7 60.33,13.97 32.38,6.35 32.38,7.62 32.38,8.89 32.38,10.16 32.38,11.43 32.38,12.7 32.38,13.97 32.38,15.24 32.38,16.51 32.38,17.78 32.38,19.05 32.38,20.32 1.27,64.14 1.27,66.04 1.27,67.94 1.27,69.85 1.27,71.75 1.27,73.66 53.66,1.27 55.56,1.27 57.47,1.27 59.37,1.27 61.28,1.27 63.18,1.27 65.09,1.27 66.99,1.27 68.9,1.27 70.8,1.27 72.71,1.27 74.93,8.89 74.93,10.79 74.93,12.7 74.93,14.61 74.93,16.51 74.93,18.41 74.93,81.92 74.93,83.82 74.93,85.72 74.93,87.63 63.5,87.63 61.59,87.63 59.69,87.63 57.78,87.63 55.88,87.63 53.98,87.63 52.07,87.63 50.16,87.63 48.26,87.63 46.35,87.63 44.45,87.63 42.55,87.63 40.64,87.63 38.73,87.63 36.83,87.63 34.92,87.63 33.02,87.63 31.11,87.63 29.21,87.63 27.3,87.63 25.4,87.63 23.5,87.63 21.59,87.63 19.68,87.63 74.93,60.96 74.93,59.05 74.93,57.15 74.93,55.24 74.93,53.34 74.93,51.44 74.93,49.53 74.93,39.37 74.93,37.47 74.93,35.56 74.93,33.66 74.93,31.75 74.93,29.84 74.93,27.94 74.93,70.48 73.66,36.51 41.59,52.39 52.7,52.39 50.8,52.39 73.66,52.39 17.78,59.69 17.78,61.59 17.78,27.94 17.78,26.04
  pour Top (isolate 0.305): 75.88,0.32 0.32,0.32 0.32,88.58 75.88,88.58
  pour Bottom: 0.32,88.58 75.88,88.58 75.88,0.32 0.32,0.32
N$1
  Top 0.305: U1.19 41.9,26.37 41.59,26.67 L1.2
N$2
  Top 0.305: D4.2 66.04,66.04
  Top 1.016: C18.1 66.04,66.04 TX_IN.C
N$3
  Top 0.813: C17.2 63.02,66.19 C18.2
  Top 1.016: U2.2 C18.2
N$4
  Top 0.61: L3.2 36.98,20.32 C5.1
N$5
  Top 0.203: 39.85,21.46 U1.5
  Top 0.61: C6.1 C5.2 39.53,20.64 39.85,20.95 39.85,21.46
N$6
  Top 0.203: U1.11 45.24,21.46
  Top 0.61: C9.1 R1.2 45.56,20.48 45.24,20.8 45.24,21.46
N$8
  Top 0.305: D2.2 62.87,19.68
  Top 1.016: C10.2 62.87,19.68 RX_OUT_UFL.SIG
N$9
  Top 0.813: C10.1 63.02,22.71 C11.1
  Top 1.016: FLT3.5 C11.1
N$10
  Top 0.305: U1.17 43.2,26.37 43.5,26.67 L2.2
N$14
  Top 0.305: D5.2 62.87,69.22
  Top 1.016: TX_IN_UFL.SIG 62.87,69.22 C17.1
RF_ANT
  Top 0.305: D1.2 66.04,44.45
  Top 1.016: FLT1.ANT 66.04,44.45 ANT.C
RF_DOWNLINK
  Top 0.813: FLT1.HI 31.37,66.04
  Top 1.016: 31.37,66.04 U2.5
RF_UPLINK
  Top 0.305: 39.05,22.86 U1.3
  Top 0.61: 38.42,22.86 39.05,22.86
  Top 0.813: L3.1 | FLT1.LO 31.37,22.86
  Top 1.016: 38.42,22.86 L3.1 31.37,22.86
RF_UPLINK_IS_IN
  Top 0.203: 45.89,15.53 C8.1
  Top 0.305: 43.2,19.38 U1.9
  Top 0.61: 43.2,18.91 43.2,19.38
  Top 1.016: FLT2.5 44.45,12.06 arc135 45.89,15.53 43.79,17.47 arc-45 43.2,18.91
RF_UPLINK_IS_OUT
  Top 0.203: C7.1 39.2,15.53
  Top 0.305: 41.9,19.38 U1.7
  Top 0.61: 41.9,18.91 41.9,19.38
  Top 0.813: 40.64,12.06 FLT2.2
  Top 1.016: 41.9,18.91 arc-45 41.3,17.47 39.2,15.53 arc135 40.64,12.06
RF_UPLINK_LNA_OUT
  Top 0.305: U1.13 46.04,22.86
  Top 0.61: 46.04,22.86 46.67,22.86
  Top 1.016: 46.67,22.86 FLT3.2
RF_UPLINK_OUT
  Top 0.305: D3.2 66.04,22.86
  Top 1.016: C11.2 66.04,22.86 RX_OUT.C
(copper drawn outside any net)
  shapes: Top area x3

### Text on the board
tPlace: sysmocom gmbh | (c) Munaut.S | CC-BY-SA
tNames: osmo-bts-amp | v2.1 20120518